# Altium project Glove Controller.PrjPcb (part 3 of 5)
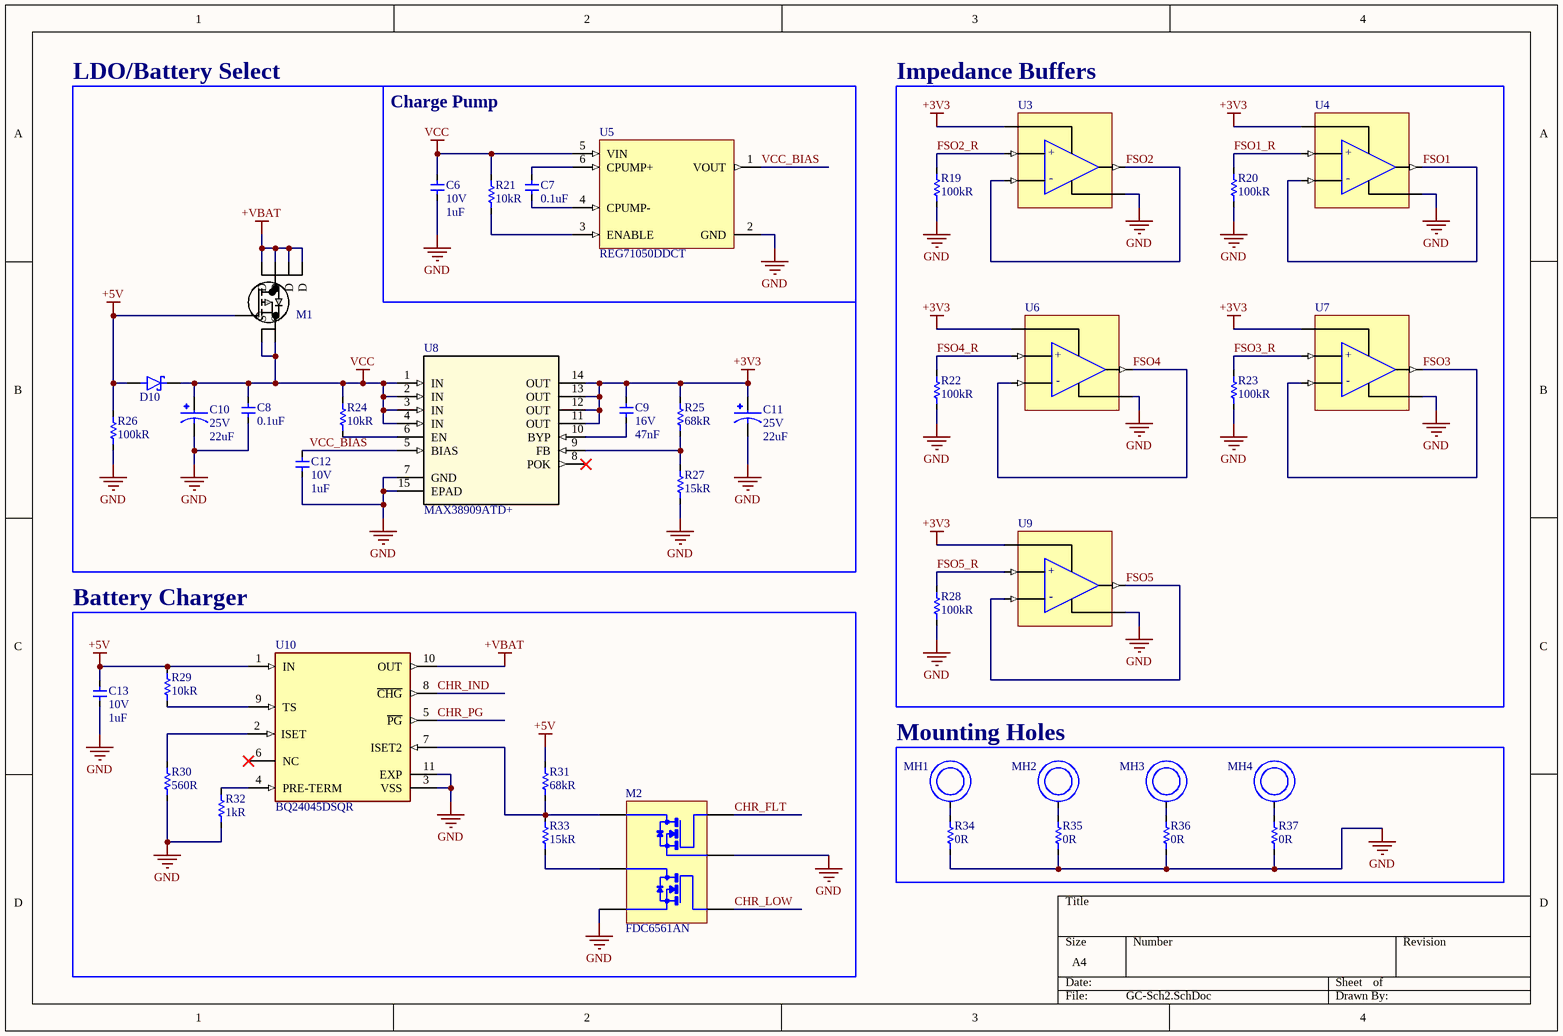
[diagram p3: GC-Sch2.SchDoc]

## Sheet GC-Sch2.SchDoc (continued)

### Parts
C6  Rated DC Voltage (URdc): 10V  Capacitance: 1uF  [0603 - C]  (hidden comment: CL10B105KP8NNNC)
C7  Capacitance: 0.1uF  [0603 - C]  (hidden comment: CL10B104JB8NNNC)
C8  Capacitance: 0.1uF  [0603]  (hidden comment: CL10B104JB8NNNC)
C9  Rated DC Voltage (URdc): 16V  Capacitance: 47nF  [0603 - C]  (hidden comment: CL10B473KO8NNNC)
C10  Rated DC Voltage (URdc): 25V  Capacitance: 22uF  [CC-25SVPF47M]  (hidden comment: EEE-FP1E220AR)
C11  Rated DC Voltage (URdc): 25V  Capacitance: 22uF  [CC-25SVPF47M]  (hidden comment: EEE-FP1E220AR)
C12  Rated DC Voltage (URdc): 10V  Capacitance: 1uF  [0603]  (hidden comment: CL10B105KP8NNNC)
C13  Rated DC Voltage (URdc): 10V  Capacitance: 1uF  [0603 - C]  (hidden comment: CL10B105KP8NNNC)
D10  D-BAT760-7  [SOD2513X120N]  (value not drawn)
M1  SIA427ADJ-T1-GE3  [SON_1DJ-T1-GE3_VIS]  (value not drawn)
M2  FDC6561AN  [SOT95P280X110-6N]
MH1  M3 Screws  [M3 Screws]  (value not drawn)
MH2  M3 Screws  [M3 Screws]  (value not drawn)
MH3  M3 Screws  [M3 Screws]  (value not drawn)
MH4  M3 Screws  [M3 Screws]  (value not drawn)
R19  Resistance: 100kR  [0603 - R]  (hidden comment: RC0603FR-07100KL)
R20  Resistance: 100kR  [0603 - R]  (hidden comment: RC0603FR-07100KL)
R21  Resistance: 10kR  [0603 - R]  (hidden comment: AC0603FR-1310KL)
R22  Resistance: 100kR  [0603 - R]  (hidden comment: RC0603FR-07100KL)
R23  Resistance: 100kR  [0603 - R]  (hidden comment: RC0603FR-07100KL)
R24  Resistance: 10kR  [0603 - R]  (hidden comment: AC0603FR-1310KL)
R25  Resistance: 68kR  [0603 - R]  (hidden comment: ERA-3AEB683V)
R26  Resistance: 100kR  [0603 - R]  (hidden comment: RC0603FR-07100KL)
R27  Resistance: 15kR  [0603 - R]  (hidden comment: ERA-3AEB153V)
R28  Resistance: 100kR  [0603 - R]  (hidden comment: RC0603FR-07100KL)
R29  Resistance: 10kR  [0603 - R]  (hidden comment: AC0603FR-1310KL)
R30  Resistance: 560R  [0603 - R]  (hidden comment: ERJ-3EKF5600V)
R31  Resistance: 68kR  [0603 - R]  (hidden comment: ERA-3AEB683V)
R32  Resistance: 1kR  [0603 - R]  (hidden comment: RC0603FR-071KL)
R33  Resistance: 15kR  [0603 - R]  (hidden comment: ERA-3AEB153V)
R34  Resistance: 0R  [0603 - R]  (hidden comment: ERJ-3GEY0R00V)
R35  Resistance: 0R  [0603 - R]  (hidden comment: ERJ-3GEY0R00V)
R36  Resistance: 0R  [0603 - R]  (hidden comment: ERJ-3GEY0R00V)
R37  Resistance: 0R  [0603 - R]  (hidden comment: ERJ-3GEY0R00V)
U3  MCP6071T-E/OT  [SOT95P270X145-5N]  (value not drawn)
U4  MCP6071T-E/OT  [SOT95P270X145-5N]  (value not drawn)
U5  REG71050DDCT  [SOT95P280X110-6N]
U6  MCP6071T-E/OT  [SOT95P270X145-5N]  (value not drawn)
U7  MCP6071T-E/OT  [SOT95P270X145-5N]  (value not drawn)
U8  MAX38909ATD+  [21-0137I_T1433-2_MXM]
U9  MCP6071T-E/OT  [SOT95P270X145-5N]  (value not drawn)
U10  BQ24045DSQR  [IC_BQ24045DSQR]

### Blocks framed on the sheet
LDO/Battery Select: C8-C12 D10 M1 R24-R27 U8
Charge Pump: C6 C7 R21 U5
Impedance Buffers: R19 R20 R22 R23 R28 U3 U4 U6 U7 U9
Battery Charger: C13 M2 R29-R33 U10
Mounting Holes: MH1-MH4 R34-R37

### Nets
+3V3: C9.2 C11.1 R25.2 U3.5(VDD) U4.5(VDD) U6.5(VDD) U7.5(VDD) U8.11(OUT) U8.12(OUT) U8.13(OUT) U8.14(OUT) U9.5(VDD)
+5V: C13.2 D10.A M1.3(G) R26.2 R29.2 R31.2 U10.1(IN)
+VBAT: M1.1(D) M1.2(D) M1.5(D) M1.6(D) U10.10(OUT)
GND: C6.1 C8.1 C10.2 C11.2 C12.1 C13.1 M2.2(S2) M2.5(S1) R19.1 R20.1 R22.1 R23.1 R26.1 R27.1 R28.1 R30.1 R32.1 R34.1 R35.1 R36.1 R37.1 U3.2(VSS) U4.2(VSS) U5.2(GND) U6.2(VSS) U7.2(VSS) U8.7(GND) U8.15(EPAD) U9.2(VSS) U10.3(VSS) U10.11(EXP)
VCC: C6.2 C8.2 C10.1 D10.C(K) M1.4(S) M1.7(S) R21.2 R24.2 U5.5(VIN) U8.1(IN) U8.2(IN) U8.3(IN) U8.4(IN)
CHR_FLT: M2.3(G2)
CHR_IND: U10.8(~{CHG})
CHR_LOW: M2.1(G1)
CHR_PG: U10.5(~{PG})
FSO1: U4.1(VOUT) U4.4(VIN-)
FSO1_R: R20.2 U4.3(VIN+)
FSO2: U3.1(VOUT) U3.4(VIN-)
FSO2_R: R19.2 U3.3(VIN+)
FSO3: U7.1(VOUT) U7.4(VIN-)
FSO3_R: R23.2 U7.3(VIN+)
FSO4: U6.1(VOUT) U6.4(VIN-)
FSO4_R: R22.2 U6.3(VIN+)
FSO5: U9.1(VOUT) U9.4(VIN-)
FSO5_R: R28.2 U9.3(VIN+)
VCC_BIAS: C12.2 U5.1(VOUT) U8.5(BIAS)
NetC7_1: C7.1 U5.4(CPUMP-)
NetC7_2: C7.2 U5.6(CPUMP+)
NetC9_1: C9.1 U8.10(BYP)
NetM2_4: M2.4(D2) R31.1 R33.2 U10.7(ISET2)
NetM2_6: M2.6(D1) R33.1
NetMH1_1: MH1.1 R34.2
NetMH2_1: MH2.1 R35.2
NetMH3_1: MH3.1 R36.2
NetMH4_1: MH4.1 R37.2
NetR21_1: R21.1 U5.3(ENABLE)
NetR24_1: R24.1 U8.6(EN)
NetR25_1: R25.1 R27.2 U8.9(FB)
NetR29_1: R29.1 U10.9(TS)
NetR30_2: R30.2 U10.2(ISET)
NetR32_2: R32.2 U10.4(PRE-TERM)

Not connected (* = marked no-connect by the designer): U8 8(POK)*; U10 6(NC)*